# Altium schematic sheet sync_rectification_module.SchDoc
size A3; SheetNumber: 1; SheetTotal: 1
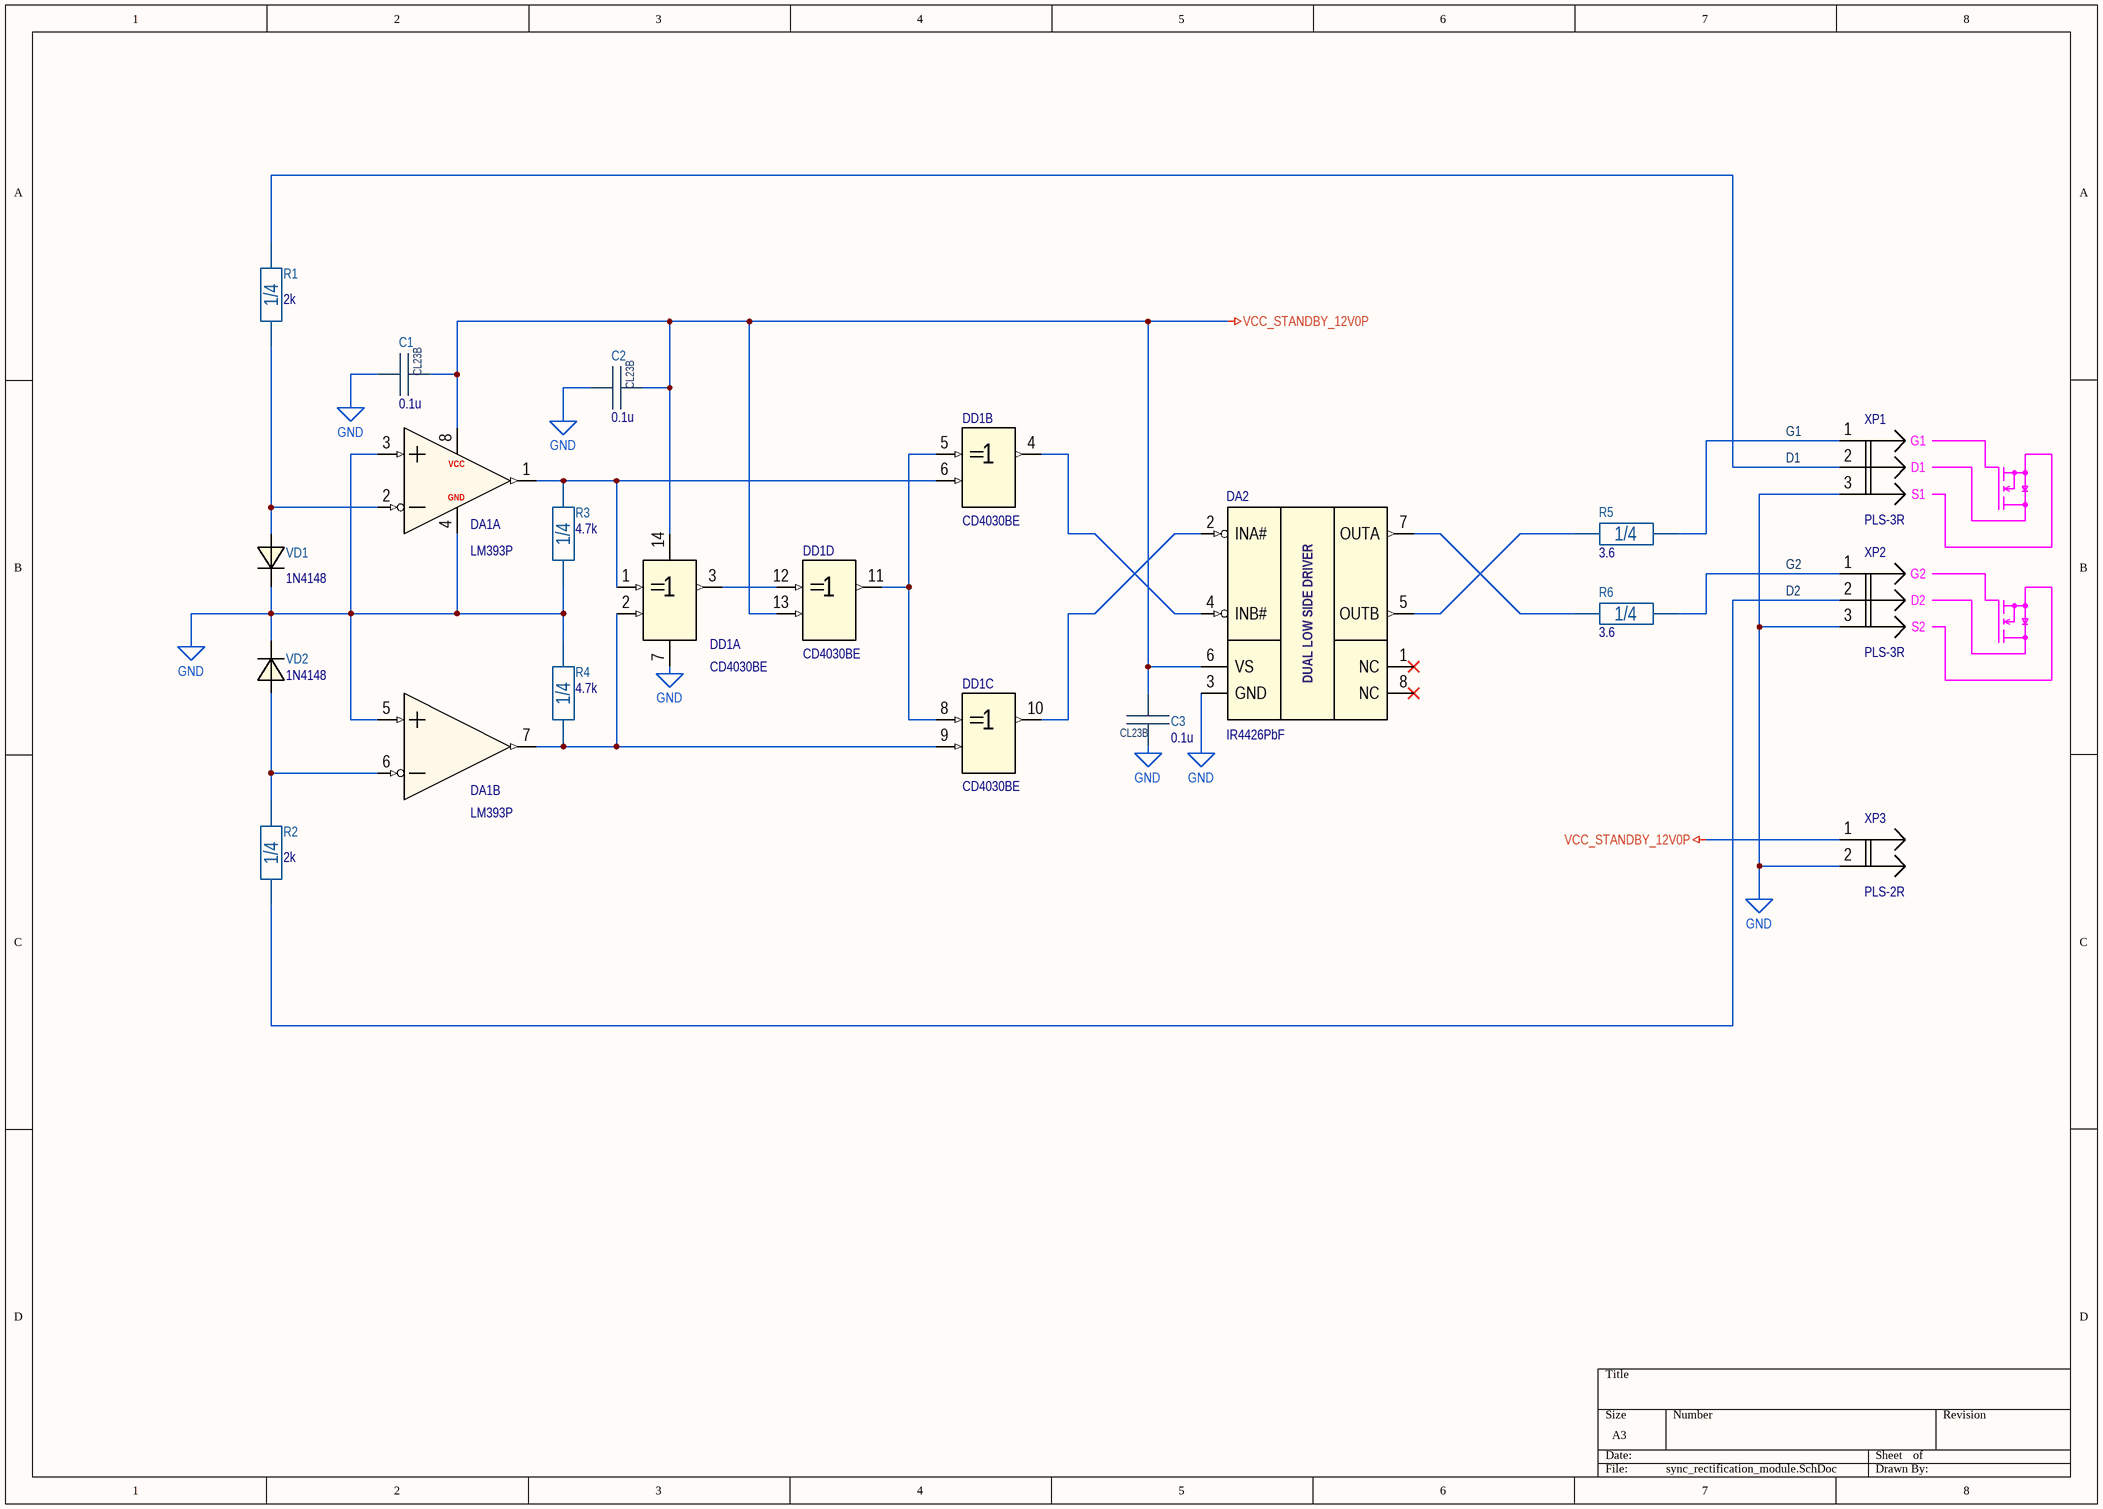
[diagram p0: sync_rectification_module.SchDoc]

## Parts
C1  0.1u  [CL23B_7.2x2.5]
C2  0.1u  [CL23B_7.2x2.5]
C3  0.1u  [CL23B_7.2x2.5]
DA1  LM393P  [DIP-8P-M01_with_SO8]  (parts A,B of 2)
DA2  IR4426PbF  [DIP-8P-M01_with_SO8]
DD1  CD4030BE  [DIP-14P-M02]  (parts A,B,C,D of 4)
R1  2k  Package: 1/4  [CFR-25(VERTICAL)]
R2  2k  Package: 1/4  [CFR-25]
R3  4.7k  Package: 1/4  [CFR-25(VERTICAL)]
R4  4.7k  Package: 1/4  [CFR-25(VERTICAL)]
R5  3.6  Package: 1/4  [CFR-25(VERTICAL)]
R6  3.6  Package: 1/4  [CFR-25]
VD1  1N4148  [DO-35 GLASS LIGHT RED]
VD2  1N4148  [DO-35 GLASS LIGHT RED]
XP1  PLS-3R  [PLS-3R]
XP2  PLS-3R  [PLS-3R]
XP3  PLS-2R  [PLS-2R]

## Nets
GND: C1.2 C2.2 C3.2 DA1.3(1IN+) DA1.4(GND) DA1.5(2IN+) DA2.3(GND) DD1.7(GND) R3.2 R4.2 VD1.1 VD2.1 XP1.3 XP2.3 XP3.2
VCC_STANDBY_12V0P: C1.1 C2.1 C3.1 DA1.8(VCC) DA2.6(VS) DD1.13(B3) DD1.14(VCC) XP3.1
D1: R1.2 XP1.2
D2: R2.1 XP2.2
G1: R5.2 XP1.1
G2: R6.2 XP2.1
NetDA1_1: DA1.1(1OUT) DD1.1(A0) DD1.6(B1) R3.1
NetDA1_2: DA1.2(1IN-) R1.1 VD1.2
NetDA1_6: DA1.6(2IN-) R2.2 VD2.2
NetDA1_7: DA1.7(2OUT) DD1.2(B0) DD1.9(B2) R4.1
NetDA2_2: DA2.2(INA#) DD1.10(Y2)
NetDA2_4: DA2.4(INB#) DD1.4(Y1)
NetDA2_5: DA2.5(OUTB) R5.1
NetDA2_7: DA2.7(OUTA) R6.1
NetDD1_3: DD1.3(Y0) DD1.12(A3)
NetDD1_5: DD1.5(A1) DD1.8(A2) DD1.11(Y3)

Not connected (* = marked no-connect by the designer): DA2 1(NC)* 8(NC)*

## Notes on the sheet
- (near XP1) G1
- (near XP1) S1
- (near XP1) D1
- (near XP2) G2
- (near XP2) S2
- (near XP2) D2

## Library data of the parts
C1-C3 = CL23B: Box-type metallized polyester film capacitor; Tolerance: ± * %; Voltage: 63V; Value: 0.1u; Dielectric: Polyester; Value on schem: 0.1u; Part Number: *; Manufacturer: *; Package: CL23B
DA1 = LM393P: Dual Comparator; Manufacturer: Texas Instruments; Part Number: LM393P; Package: DIP-8
DA2 = IR4426PbF: DUAL LOW SIDE DRIVER; Manufacturer: International Rectifier; Part Number: IR4426PbF; Package: SOIC-8
DD1 = CD4030BE: Quad XOR-Gate; Manufacturer: Texas Instruments; Part Number: CD4030BE; Package: DIP-14
R1 R2 = CF25: Resistor 1/4W; Part Number: MFR-25FTF52-2K; Manufacturer: Yageo; Tolerance: ± 1 %; Voltage: 250V; Temperature Coefficient: ±100 ppm/°C; Value: 2k; Value on schem: 2k
R3 R4 = CF25: Resistor 1/4W; Part Number: MFR-25FTF52-4K7; Manufacturer: Yageo; Tolerance: ± 1 %; Voltage: 250V; Temperature Coefficient: ±100 ppm/°C; Value: 4.7k; Value on schem: 4.7k
R5 R6 = CF25: Resistor 1/4W; Part Number: MFR-25FTF52-3R6; Manufacturer: Yageo; Tolerance: ± 1 %; Voltage: 250V; Temperature Coefficient: ±100 ppm/°C; Value: 3.6; Value on schem: 3.6
VD1 VD2 = 1N4148: High-speed diode; Package: DO-35; Part Number: 1N4148
XP1 XP2 = PLS-3R: Value: PLS-3R
XP3 = PLS-2R: Value: PLS-2R